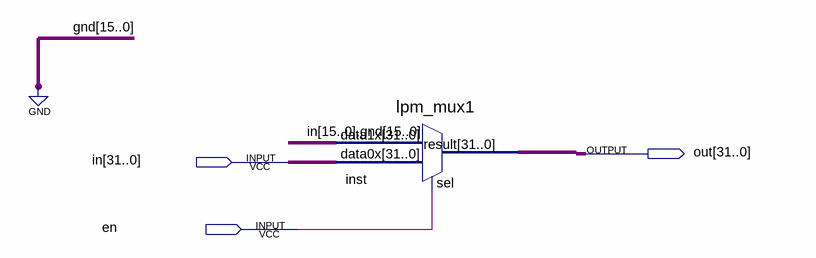
[diagram p0: schematic sheet]
// Quartus schematic shift_left_16bit.bdf as structural Verilog: 1 symbols, 3 pins
module shift_left_16bit (
  input  [31:0] in,
  input  en,
  output [31:0] out
);

  lpm_mux1 inst (.data1x({in[15:0], {16{1'b0}}}), .data0x(in), .sel(en), .result(out));
endmodule
